# EAGLE design micromouse (EAGLE 9.0.1)
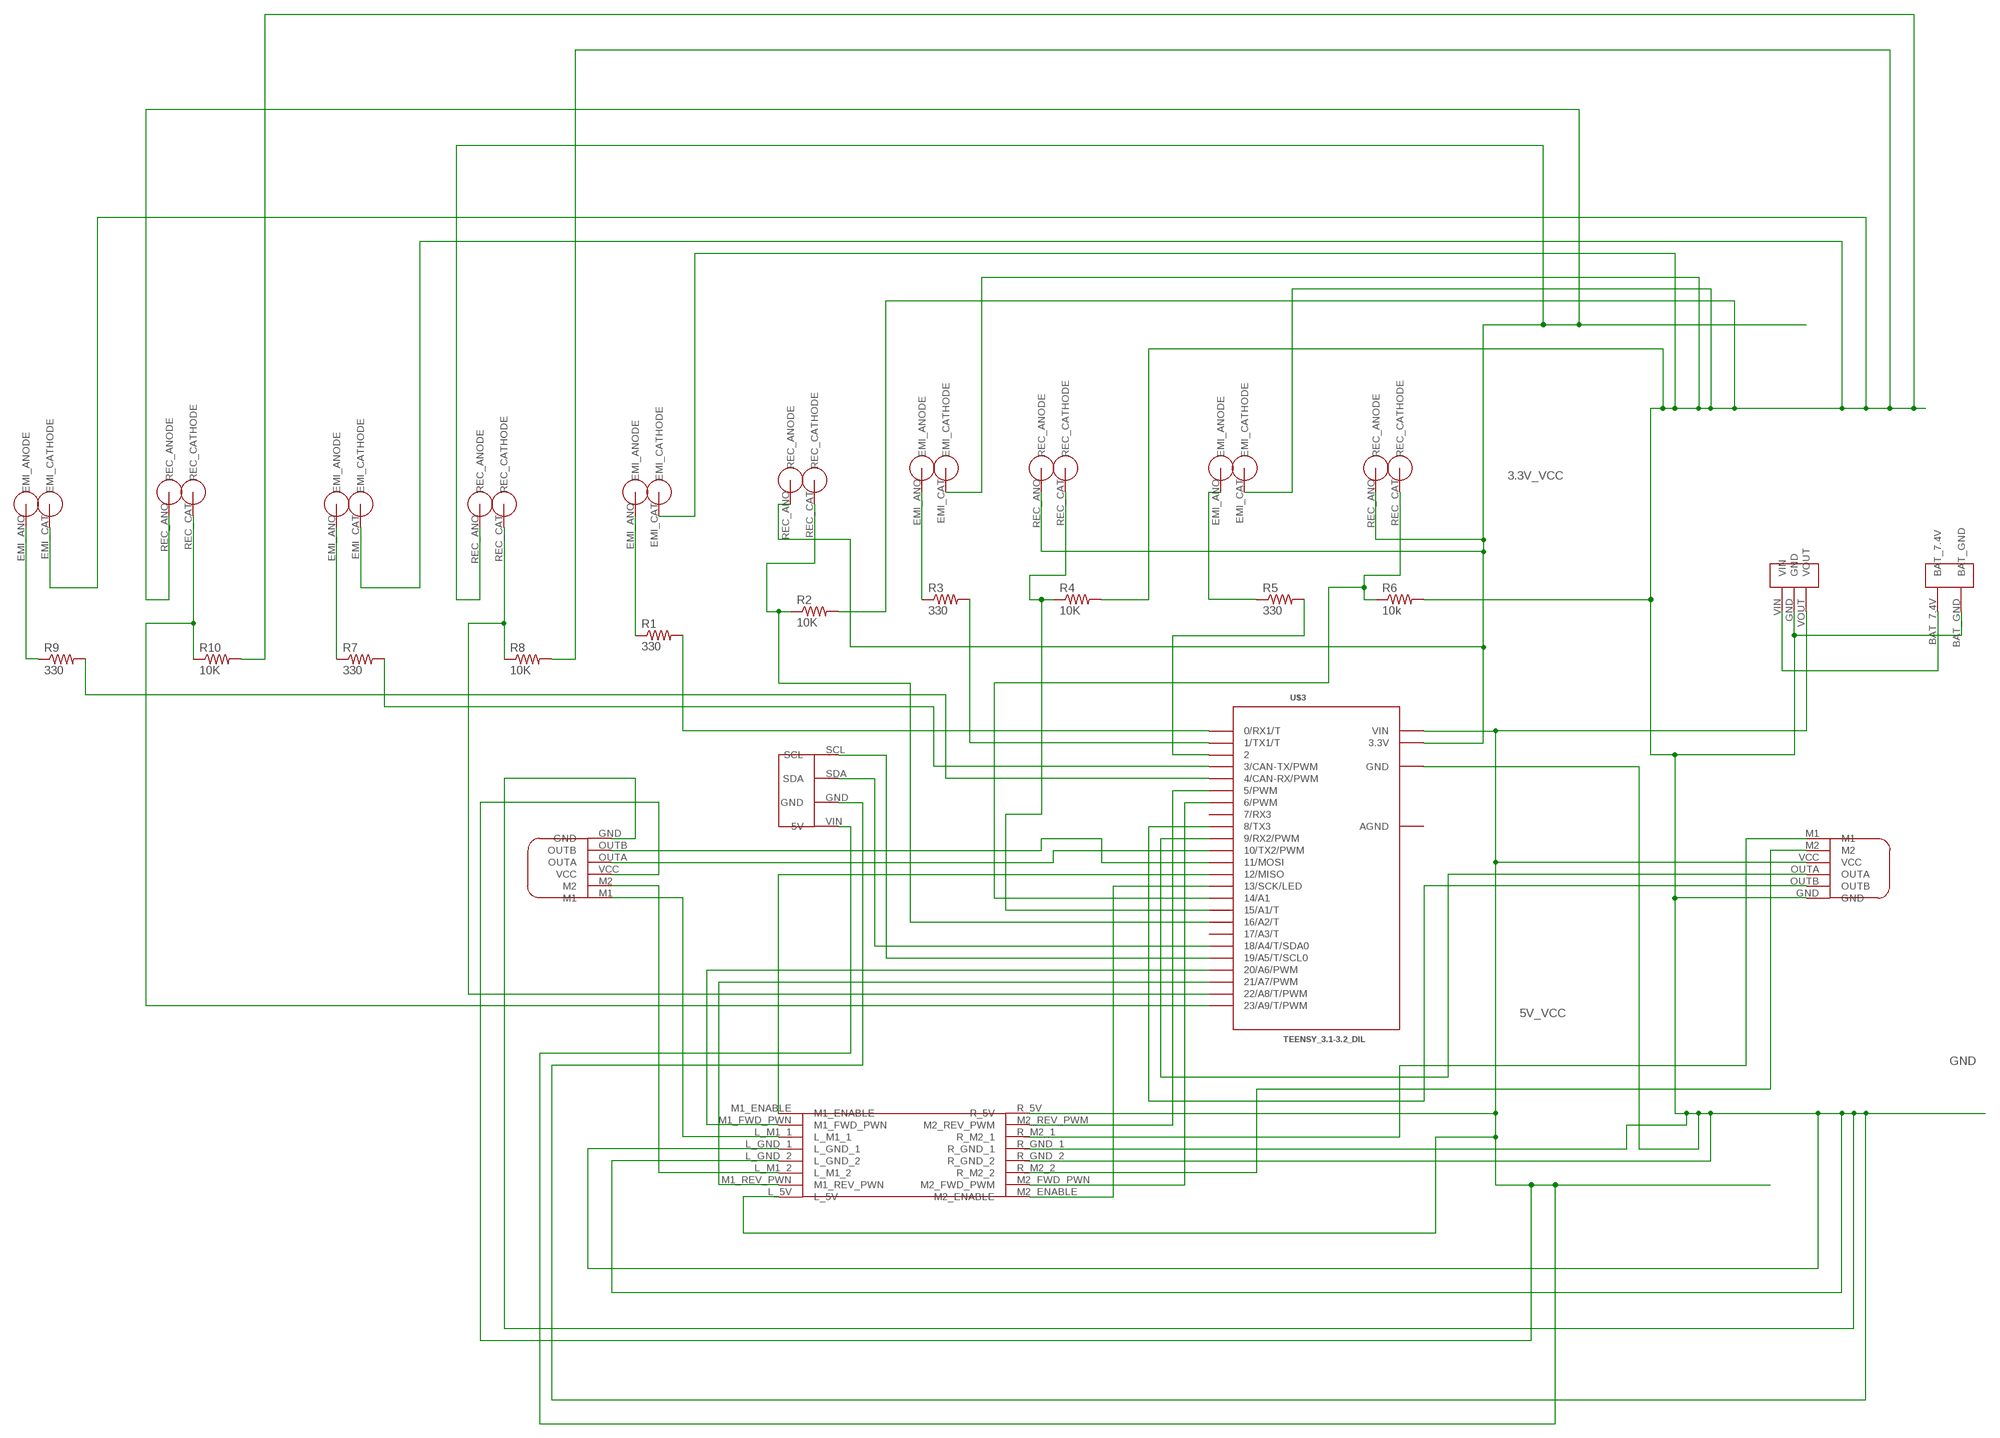
[diagram p0: schematic, sheet 1]

## Parts
R1  330  R-US_0207/10  [0207/10]
R2  10K  R-US_0207/10  [0207/10]
R3  330  R-US_0207/10  [0207/10]
R4  10K  R-US_0207/10  [0207/10]
R5  330  R-US_0207/10  [0207/10]
R6  10k  R-US_0207/10  [0207/10]
R7  330  R-US_0207/10  [0207/10]
R8  10K  R-US_0207/10  [0207/10]
R9  330  R-US_0207/10  [0207/10]
R10  10K  R-US_0207/10  [0207/10]
U$1  MOTOR_ENCODER  [MOTOR_ENCODER]
U$2  MOTOR_ENCODER  [MOTOR_ENCODER]
U$3  TEENSY_3.1-3.2_DIL  [TEENSY_3.0-3.2&LC_DIL]
U$4  MOTOR_DRIVER  [MOTOR_DRIVER]
U$5  IR_RECIEVER  [IR_RECIEVER]
U$6  IR_EMITTER  [IR_EMITTER]
U$7  IR_EMITTER  [IR_EMITTER]
U$8  IR_RECIEVER  [IR_RECIEVER]
U$9  IR_EMITTER  [IR_EMITTER]
U$10  VOLTAGE_REGULATOR  [VOLTAGE_REGULATOR]
U$11  BATTERY_INPUT  [BATTERY_INPUT]
U$12  IR_RECIEVER  [IR_RECIEVER]
U$13  IMU  [IMU]
U$14  IR_EMITTER  [IR_EMITTER]
U$15  IR_RECIEVER  [IR_RECIEVER]
U$16  IR_EMITTER  [IR_EMITTER]
U$17  IR_RECIEVER  [IR_RECIEVER]

## Nets
3.3V_VCC: U$3.3.3V U$5.REC_ANO(REC_ANODE) U$8.REC_ANO(REC_ANODE) U$12.REC_ANO(REC_ANODE) U$15.REC_ANO(REC_ANODE) U$17.REC_ANO(REC_ANODE)
5V_VCC: U$1.VCC U$2.VCC U$3.VIN U$4.L_5V U$4.R_5V U$10.VOUT U$13.VIN(5V)
GND: R2.2 R4.2 R6.2 R8.2 R10.2 U$1.GND U$2.GND U$3.GND U$4.L_GND_1 U$4.L_GND_2 U$4.R_GND_1 U$4.R_GND_2 U$6.EMI_CAT(EMI_CATHODE) U$7.EMI_CAT(EMI_CATHODE) U$9.EMI_CAT(EMI_CATHODE) U$10.GND U$11.BAT_GND U$13.GND U$14.EMI_CAT(EMI_CATHODE) U$16.EMI_CAT(EMI_CATHODE)
M1_FWD_PWM: U$3.20/A6(20/A6/PWM) U$4.M1_FWD_PWN
M1_L: U$1.M1 U$4.L_M1_1
M1_R: U$2.M1 U$4.R_M2_1
M1_REV_PWM: U$3.21/A7(21/A7/PWM) U$4.M1_REV_PWN
M2_ENABLE: U$3.13(13/SCK/LED) U$4.M2_ENABLE
M2_FWD_PWM: U$3.6(6/PWM) U$4.M2_FWD_PWN(M2_FWD_PWM)
M2_L: U$1.M2 U$4.L_M1_2
M2_R: U$2.M2 U$4.R_M2_2
N$1: U$10.VIN U$11.BAT_7.4V
N$2: U$3.19/A5(19/A5/T/SCL0) U$13.SCL
N$3: U$3.18/A4(18/A4/T/SDA0) U$13.SDA
N$4: U$3.12(12/MISO) U$4.M1_ENABLE
N$5: U$3.5(5/PWM) U$4.M2_REV_PWM
N$6: R7.2 U$3.3(3/CAN-TX/PWM)
N$7: R7.1 U$14.EMI_ANO(EMI_ANODE)
N$8: R8.1 U$3.22/A8(22/A8/T/PWM) U$15.REC_CAT(REC_CATHODE)
N$9: R9.2 U$3.4(4/CAN-RX/PWM)
N$10: R9.1 U$16.EMI_ANO(EMI_ANODE)
N$12: R10.1 U$3.23/A9(23/A9/T/PWM) U$17.REC_CAT(REC_CATHODE)
N$19: R1.2 U$3.0(0/RX1/T)
N$20: R1.1 U$9.EMI_ANO(EMI_ANODE)
N$21: R6.1 U$3.14/A0(14/A1) U$8.REC_CAT(REC_CATHODE)
N$22: R3.2 U$3.1(1/TX1/T)
N$23: R3.1 U$6.EMI_ANO(EMI_ANODE)
N$24: R4.1 U$3.15/A1(15/A1/T) U$12.REC_CAT(REC_CATHODE)
N$25: R5.2 U$3.2
N$26: R5.1 U$7.EMI_ANO(EMI_ANODE)
N$28: R2.1 U$3.16/A2(16/A2/T) U$5.REC_CAT(REC_CATHODE)
OUTA_L: U$1.OUTA U$3.10(10/TX2/PWM)
OUTA_R: U$2.OUTA U$3.9(9/RX2/PWM)
OUTB_L: U$1.OUTB U$3.11(11/MOSI)
OUTB_R: U$2.OUTB U$3.8(8/TX3)
Unconnected: U$3.7(7/RX3) U$3.17/A3(17/A3/T)

## Power pins joined to a net without a drawn wire
AGND: U$3.AGND

## Library data of the parts
R1-R10 = rcl:R-US_: RESISTOR, American symbol; SPICEPREFIX: R
U$1 U$2 = MOTOR_ENCODER:MOTOR_ENCODER
U$3 = Teensy_3_and_LC_Series_Boards_v1.4:TEENSY_3.1-3.2_DIL: Teensy 3.1 or 3.2 in a DIL Layout.
U$4 = motor_driver:MOTOR_DRIVER
U$5 U$8 U$12 U$15 U$17 = IR_RECIEVER:IR_RECIEVER
U$6 U$7 U$9 U$14 U$16 = IR_EMITTER:IR_EMITTER
U$10 = VOLTAGE_REGULATOR:VOLTAGE_REGULATOR
U$11 = Battery_input:BATTERY_INPUT
U$13 = IMU:IMU

## Board
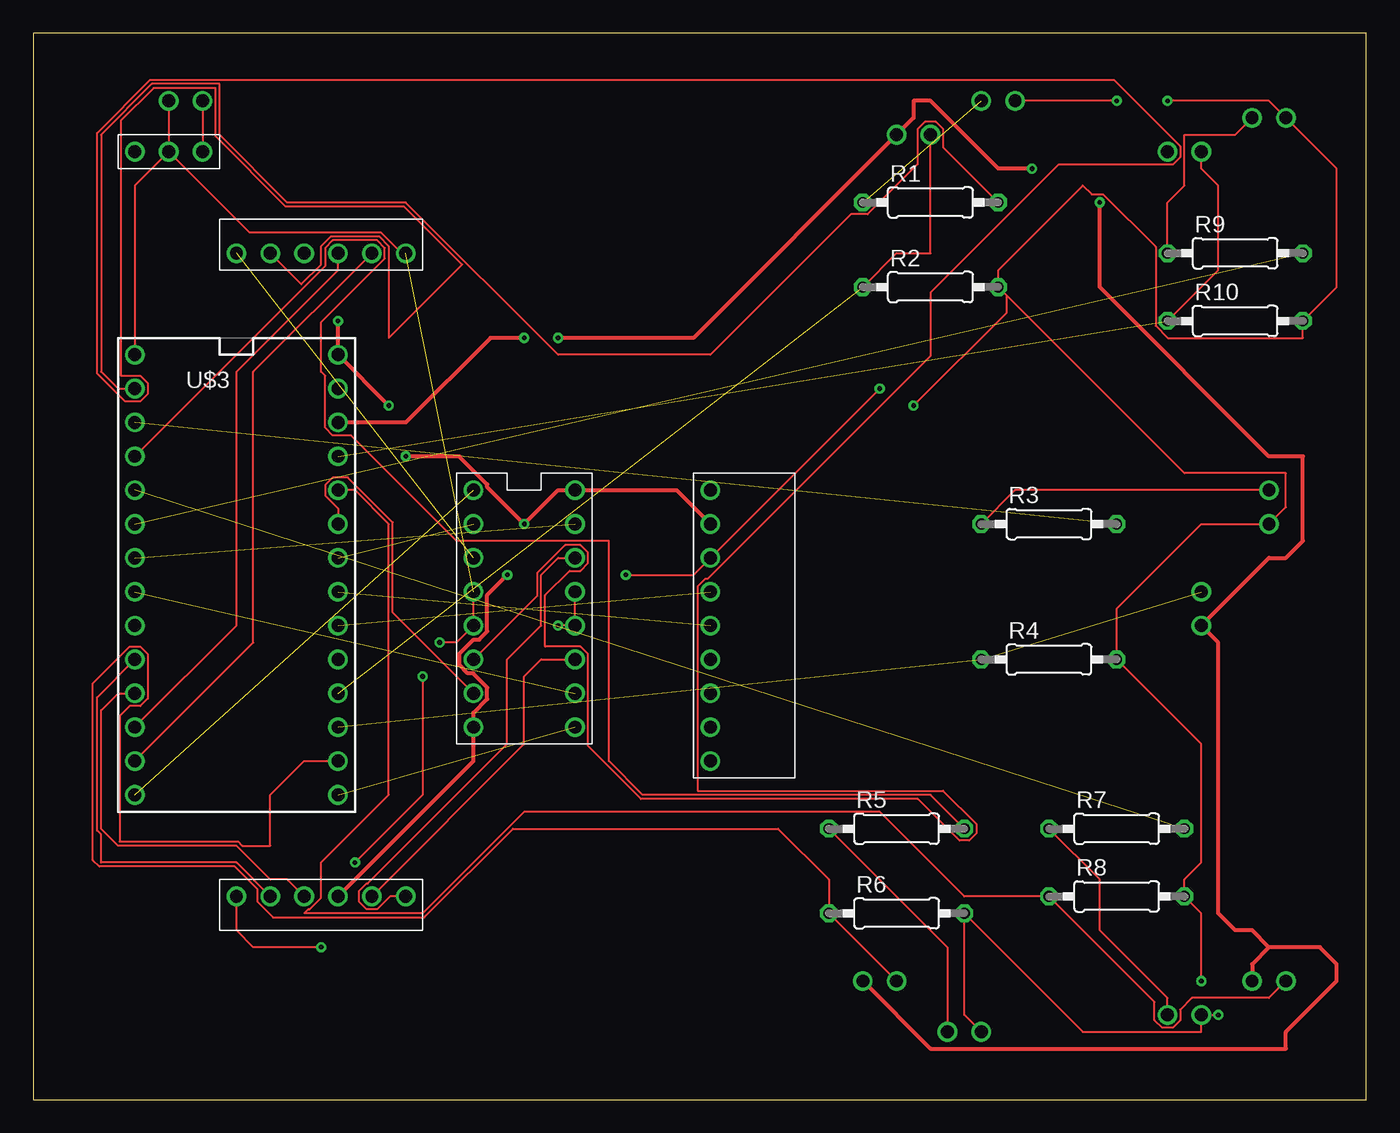
[diagram p1: board, top side]
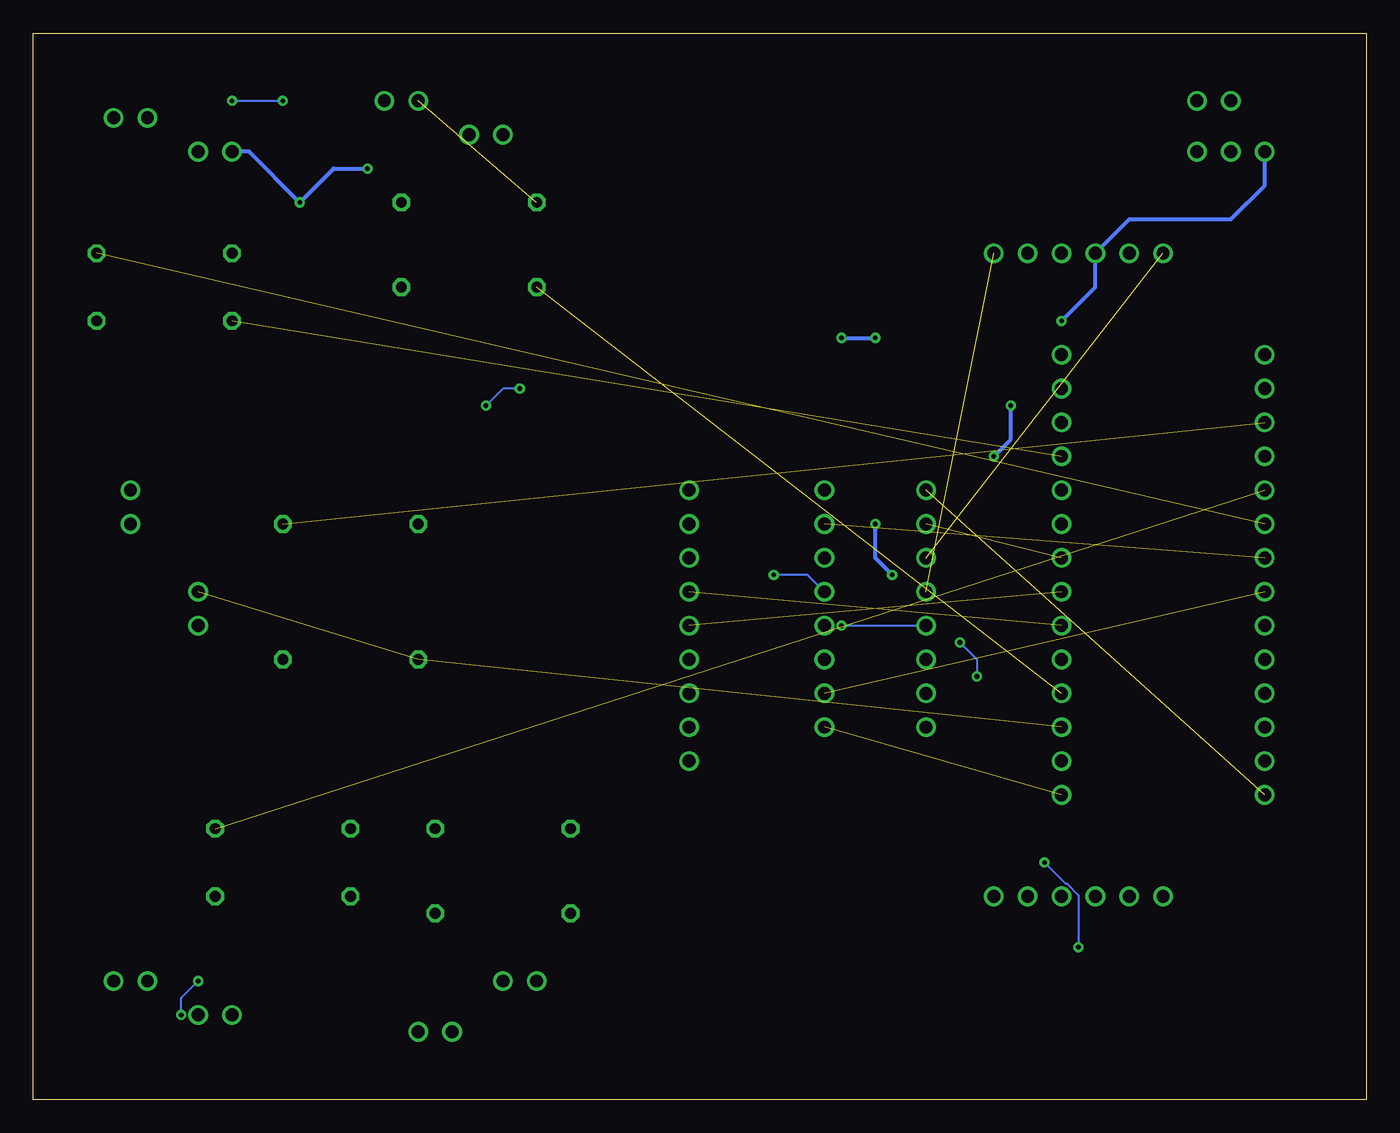
[diagram p2: board, bottom side, seen from below]

Size 100 x 80 mm. Coordinates in mm from the lower left corner, seen from the top.
Outline: 0,0 100,0 100,80 0,80 0,0
Copper layers (1*16): Top 0.035mm / dielectric 1.5mm / Bottom 0.035mm
Design rules "default": minimum track width 6mil, minimum drill 0.35mm, track to track 6mil, track to pad 6mil, pad to pad 6mil, via to via 6mil, smd to smd 6mil, copper to edge 40mil, drill to drill 6mil, minimum pad ring 10mil, minimum via ring 8mil, stop-mask expansion 4mil, vias tented up to drill 0mil, thermal gap 10mil

### Footprints (pad centres in the part's own frame; a part is rotated, then mirrored left to right if it is on the bottom)
0207/10 = drill 0.813 octagon: 1 -5.08,0; 2 5.08,0
MOTOR_ENCODER = drill 0.965: GND -1.27,3.81; M1 -1.27,-8.89; M2 -1.27,-6.35; OUTA -1.27,-1.27; OUTB -1.27,1.27; VCC -1.27,-3.81
TEENSY_3.0-3.2&LC_DIL = drill 0.965: 0 -7.62,13.97; 1 -7.62,11.43; 2 -7.62,8.89; 3 -7.62,6.35; 3.3V 7.62,11.43; 4 -7.62,3.81; 5 -7.62,1.27; 6 -7.62,-1.27; 7 -7.62,-3.81; 8 -7.62,-6.35; 9 -7.62,-8.89; 10 -7.62,-11.43; 11 -7.62,-13.97; 12 -7.62,-16.51; 13 7.62,-16.51; 14/A0 7.62,-13.97; 15/A1 7.62,-11.43; 16/A2 7.62,-8.89; 17/A3 7.62,-6.35; 18/A4 7.62,-3.81; 19/A5 7.62,-1.27; 20/A6 7.62,1.27; 21/A7 7.62,3.81; 22/A8 7.62,6.35; 23/A9 7.62,8.89; AGND 7.62,13.97; GND -7.62,16.51; VIN 7.62,16.51
MOTOR_DRIVER = drill 0.965: L_5V -3.81,-11.43; L_GND_1 -3.81,-1.27; L_GND_2 -3.81,-3.81; L_M1_1 -3.81,1.27; L_M1_2 -3.81,-6.35; M1_ENABLE -3.81,6.35; M1_FWD_PWN -3.81,3.81; M1_REV_PWN -3.81,-8.89; M2_ENABLE 3.81,-11.43; M2_FWD_PWN 3.81,-8.89; M2_REV_PWM 3.81,3.81; R_5V 3.81,6.35; R_GND_1 3.81,-1.27; R_GND_2 3.81,-3.81; R_M2_1 3.81,1.27; R_M2_2 3.81,-6.35
IR_RECIEVER = drill 0.965: REC_ANO -1.27,0; REC_CAT 1.27,0
IR_EMITTER = drill 0.965: EMI_ANO 0,0; EMI_CAT 2.54,0
VOLTAGE_REGULATOR = drill 0.965: GND 0,0; VIN 2.54,0; VOUT -2.54,0
BATTERY_INPUT = drill 0.965: BAT_7.4V -1.27,0; BAT_GND 1.27,0
IMU = drill 0.965: GND -1.27,0; NO_USE_1 -1.27,5.08; NO_USE_2 -1.27,-7.62; NO_USE_3 -1.27,-10.16; NO_USE_4 -1.27,-12.7; NO_USE_5 -1.27,-15.24; SCL -1.27,-5.08; SDA -1.27,-2.54; VIN -1.27,2.54

### Placement (x,y rotation side)
R1  67.31,67.31 0 top
R2  67.31,60.96 0 top
R3  76.2,43.18 0 top
R4  76.2,33.02 0 top
R5  64.77,20.32 0 top
R6  64.77,13.97 0 top
R7  81.28,20.32 0 top
R8  81.28,15.24 0 top
R9  90.17,63.5 0 top
R10  90.17,58.42 0 top
U$1  24.13,62.23 270 top
U$2  19.05,16.51 90 top
U$3  15.24,39.37 0 top
U$4  36.83,39.37 0 top
U$5  66.04,72.39 0 top
U$6  92.71,45.72 270 top
U$7  68.58,5.08 0 top
U$8  63.5,8.89 0 top
U$9  71.12,74.93 0 top
U$10  10.16,71.12 0 top
U$11  11.43,74.93 180 top
U$12  87.63,36.83 90 top
U$13  52.07,40.64 0 top
U$14  85.09,6.35 180 bottom
U$15  92.71,8.89 0 top
U$16  91.44,73.66 0 top
U$17  86.36,71.12 0 top

### Tracks (layer width: path | path; a pad name or v marks a point on that pad's centre or on a via)
3.3V_VCC  (via drill 0.35)
  Top 0.305: U$8.REC_ANO 67.31,3.81 93.98,3.81 93.98,5.08 97.79,8.89 97.79,10.16 96.52,11.43 92.71,11.43 | 92.71,11.43 91.44,10.16 U$15.REC_ANO | 92.71,11.43 91.44,12.7 90.17,12.7 88.9,13.97 88.9,34.29 U$12.REC_ANO 92.71,40.64 93.98,40.64 95.25,41.91 95.25,48.26 92.71,48.26 80.01,60.96 v80.01,67.31 | v74.93,69.85 72.39,69.85 67.31,74.93 66.04,74.93 66.04,73.66 U$5.REC_ANO 49.53,57.15 v39.37,57.15 | v36.83,57.15 34.29,57.15 27.94,50.8 U$3.3.3V
  Bottom 0.305: U$17.REC_ANO 83.82,71.12 v80.01,67.31 77.47,69.85 v74.93,69.85 | v39.37,57.15 v36.83,57.15
5V_VCC  (via drill 0.35)
  Top 0.305: U$2.VCC 33.02,25.4 U$4.L_5V 33.02,29.01 34.06,30.05 34.06,30.91 32.99,31.98 32.59,31.98 31.98,32.59 31.98,33.45 33.05,34.52 33.45,34.52 34.06,35.13 34.06,37.87 v35.56,39.37 | U$13.VIN 48.26,45.72 U$4.R_5V 39.37,45.72 v36.83,43.18 34.06,45.95 34.06,46.15 31.95,48.26 v27.94,48.26 | v26.67,52.07 U$3.VIN v22.86,58.42
  Bottom 0.305: v35.56,39.37 36.83,40.64 v36.83,43.18 | v27.94,48.26 26.67,49.53 v26.67,52.07 | v22.86,58.42 20.32,60.96 U$1.VCC 17.78,66.04 10.16,66.04 7.62,68.58 U$10.VOUT
GND  (via drill 0.35)  (1 unrouted)
  Top 0.152: U$4.L_GND_1 U$4.L_GND_2 31.75,34.29 v30.48,34.29 | U$4.R_GND_1 U$4.R_GND_2 v39.37,35.56 | U$11.BAT_GND U$10.GND | U$1.GND 27.63,63.5 26.05,65.08 16.2,65.08 U$10.GND | U$10.GND 7.62,68.58 U$3.GND | U$7.EMI_CAT 69.85,6.35 R6.2 78.74,5.08 87.63,5.08 U$14.EMI_CAT v88.9,6.35 | v87.63,8.89 87.63,13.97 R8.2 86.36,16.51 87.63,17.78 87.63,26.67 R4.2 81.28,36.83 87.63,43.18 U$6.EMI_CAT 93.98,44.45 93.98,46.99 86.36,46.99 73.03,60.33 | 73.03,60.33 R2.2 72.39,62.23 78.74,68.58 79.4,67.92 80.26,67.92 84.2,63.98 84.2,58.05 85.1,57.15 95.25,57.15 R10.2 97.79,60.96 97.79,69.85 U$16.EMI_CAT 92.71,74.93 v85.09,74.93 | v81.28,74.93 U$9.EMI_CAT | v29.21,31.75 29.21,22.86 v24.13,17.78 | v21.59,11.43 16.51,11.43 15.24,12.7 U$2.GND | v44.45,39.37 49.53,39.37 U$13.GND v63.5,53.34 | v66.04,52.07 73.03,59.05 73.03,60.33
  Bottom 0.152: v88.9,6.35 88.9,7.62 v87.63,8.89 | v85.09,74.93 v81.28,74.93 | v30.48,34.29 29.21,33.02 v29.21,31.75 | v24.13,17.78 22.55,16.2 22.46,16.2 21.59,15.34 v21.59,11.43 | v39.37,35.56 U$4.L_GND_2 | U$4.R_GND_1 41.91,39.37 v44.45,39.37 | v63.5,53.34 64.77,53.34 v66.04,52.07
M1_FWD_PWM  (1 unrouted)
M1_L  (1 unrouted)
M1_R
  Top 0.152: U$2.M1 26.77,15.24 25.8,14.28 25,14.28 24.43,14.84 24.43,15.64 25,16.2 25.09,16.2 35.56,26.67 35.56,33.02 38.1,35.56 38.1,39.37 39.37,40.64 U$4.R_M2_1
M1_REV_PWM
  Top 0.152: U$4.M1_REV_PWN 26.98,36.52 26.98,43.31 23.6,46.69 22.46,46.69 21.89,46.12 21.89,45.32 22.86,44.35 U$3.21/A7
M2_ENABLE  (1 unrouted)
M2_FWD_PWM  (1 unrouted)
M2_L
  Top 0.152: U$1.M2 20.1,61.18 21.59,62.66 21.59,64.03 22.33,64.77 25.93,64.77 26.67,64.03 26.67,57.15 32.17,62.65 27.81,67 18.92,67 13.66,72.26 13.66,75.89 9.02,75.89 6.56,73.44 6.56,54.3 8.02,54.3 8.59,53.74 8.59,52.94 8.02,52.38 6.88,52.38 4.78,54.48 4.78,72.52 8.76,76.5 81.07,76.5 86.06,71.52 86.06,70.72 85.49,70.16 76.92,70.16 67.31,60.54 67.31,55.78 50.59,39.06 50.4,39.06 49.84,38.5 49.84,23.16 68.26,23.16 70.74,20.69 70.74,19.95 70.22,19.43 69.48,19.43 66.36,22.55 45.59,22.55 41.6,26.54 41.6,33.42 41.04,33.98 38.41,33.98 38.41,37.84 40.24,39.67 41.04,39.67 41.6,40.24 41.6,41.04 41.04,41.6 39.9,41.6 37.8,39.5 37.8,37.8 U$4.L_M1_2
M2_R
  Top 0.152: U$2.M2 36.83,26.67 36.83,31.75 38.1,33.02 U$4.R_M2_2
N$1
  Top 0.152: U$11.BAT_7.4V U$10.VIN
N$2  (1 unrouted)
N$3  (1 unrouted)
N$4  (1 unrouted)
N$5  (1 unrouted)
N$6  (1 unrouted)
N$7
  Top 0.152: U$14.EMI_ANO 85.09,7.62 80.01,12.7 80.01,16.51 R7.1
N$8
  Top 0.152: U$15.REC_CAT 92.71,7.62 86.92,7.62 86.06,6.75 86.06,5.95 85.49,5.38 84.69,5.38 84.12,5.95 84.12,7.32 R8.1 69.85,15.24 63.5,21.59 36.83,21.59 29.21,13.97 20.32,13.97 20.62,14.28 20.72,14.28 21.59,15.14 21.59,17.78 26.67,22.86 26.67,43.18 24.13,45.72 U$3.22/A8
N$9  (1 unrouted)
N$10
  Top 0.152: R9.1 85.09,67.31 86.36,68.58 86.36,72.39 90.17,72.39 U$16.EMI_ANO
N$12  (1 unrouted)
  Top 0.152: R10.1 88.9,62.23 88.9,68.58 87.63,69.85 U$17.REC_CAT
N$19
  Top 0.152: R1.2 68.28,71.42 68.28,72.79 67.71,73.36 66.91,73.36 66.34,72.79 66.34,70.17 62.6,66.42 61.34,66.42 50.8,55.88 39.37,55.88 27.94,67.31 19.05,67.31 13.97,72.39 13.97,76.2 8.89,76.2 5.08,72.39 5.08,54.61 6.35,53.34 U$3.0
N$20  (1 unrouted)
N$21
  Top 0.152: U$8.REC_CAT R6.1 59.69,16.51 55.88,20.32 35.99,20.32 29.34,13.66 17.99,13.66 16.82,14.84 16.82,15.77 15.11,17.48 4.95,17.48 4.47,17.96 4.47,31.23 7.22,33.98 8.02,33.98 8.59,33.42 8.59,30.08 8.02,29.52 7.22,29.52 6.48,28.77 6.48,19.36 15.37,19.36 15.67,19.05 17.78,19.05 17.78,22.86 20.32,25.4 U$3.14/A0
N$22  (1 unrouted)
N$23
  Top 0.152: R3.1 73.66,45.72 U$6.EMI_ANO
N$24  (2 unrouted)
N$25
  Top 0.152: R5.2 67.31,22.86 45.72,22.86 43.18,25.4 43.18,41.91 31.75,41.91 23.82,49.84 22.46,49.84 21.89,50.4 21.89,54.3 21.59,54.61 21.59,58.33 26.36,63.1 26.36,63.9 25.8,64.47 22.46,64.47 21.89,63.9 21.89,62.53 U$3.2
N$26
  Top 0.152: R5.1 68.58,11.43 U$7.EMI_ANO
N$28  (1 unrouted)
  Top 0.152: R2.1 64.77,63.5 67.31,63.5 U$5.REC_CAT
OUTA_L
  Top 0.152: U$3.10 15.24,35.56 15.24,54.61 22.86,62.23 U$1.OUTA
OUTA_R
  Top 0.152: U$2.OUTA 19.05,16.51 17.78,16.51 15.24,19.05 6.35,19.05 5.08,20.32 5.08,29.21 6.35,30.48 U$3.9
OUTB_L
  Top 0.152: U$3.11 16.51,34.29 16.51,54.61 U$1.OUTB
OUTB_R
  Top 0.152: U$2.OUTB 15.24,17.78 5.08,17.78 5.08,19.89 4.78,20.19 4.78,30.18 U$3.8